# EAGLE schematic Inverter (EAGLE 9.6.2)
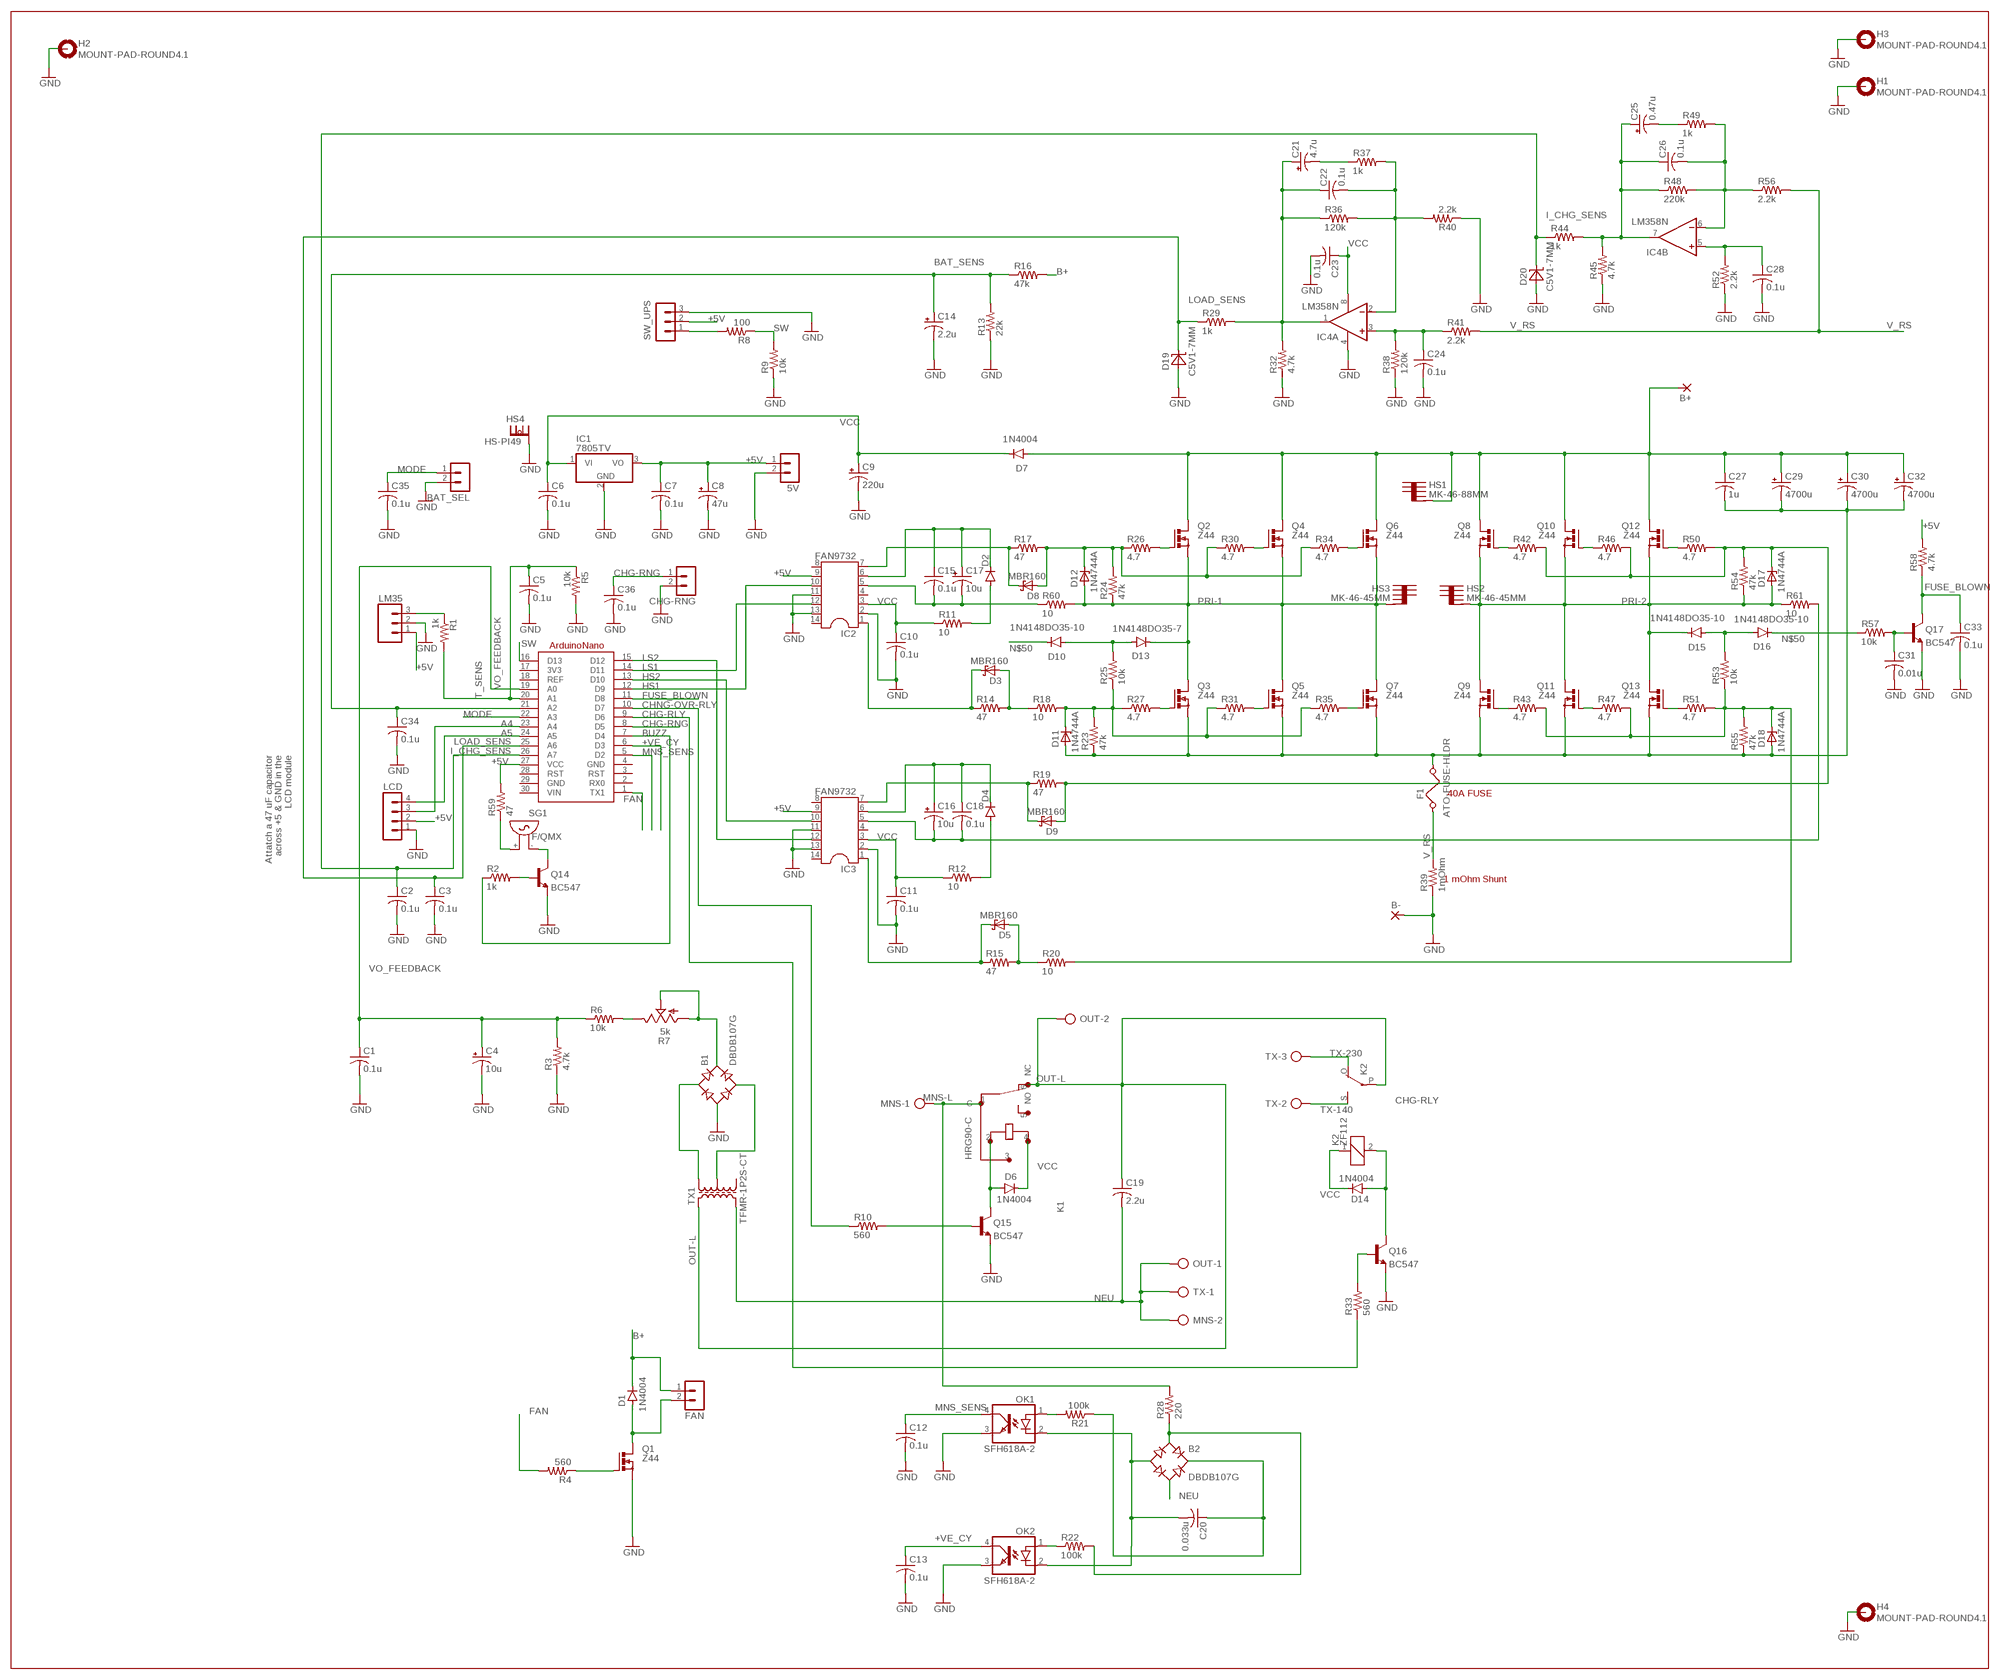
[diagram p0: schematic, sheet 1]

## Parts
5V  MA02-1  [MA02-1]
A1  ARDUINONANO-MIN-TXT  [ARDUINONANO-MINIMUM-TXT]
B1  DBDB107G  [DB]
B2  DBDB107G  [DB]
B+  3,17/1,1  [3,17/1,1]
B-  3,17/1,1  [3,17/1,1]
BAT_SEL  MA02-1  [MA02-1]
C1  0.1u  C-US025-025X050  [C025-025X050]
C2  0.1u  C-US025-025X050  [C025-025X050]
C3  0.1u  C-US025-025X050  [C025-025X050]
C4  10u  CPOL-USE2,5-6E  [E2,5-6E]
C5  0.1u  C-US025-025X050  [C025-025X050]
C6  0.1u  C-US025-025X050  [C025-025X050]
C7  0.1u  C-US025-025X050  [C025-025X050]
C8  47u  CPOL-USE2,5-6E  [E2,5-6E]
C9  220u  CPOL-USE2,5-6E  [E2,5-6E]
C10  0.1u  C-US025-025X050  [C025-025X050]
C11  0.1u  C-US025-025X050  [C025-025X050]
C12  0.1u  C-US025-025X050  [C025-025X050]
C13  0.1u  C-US025-025X050  [C025-025X050]
C14  2.2u  CPOL-USE2.5-6  [E2,5-6]
C15  0.1u  C-US025-025X050  [C025-025X050]
C16  10u  CPOL-USE2,5-6E  [E2,5-6E]
C17  10u  CPOL-USE2,5-6E  [E2,5-6E]
C18  0.1u  C-US025-025X050  [C025-025X050]
C19  2.2u  C230-POLY  [C230-85X245]
C20  0.033u  C-US050-025X075  [C050-025X075]
C21  4.7u  CPOL-USE2.5-6  [E2,5-6]
C22  0.1u  C-US025-025X050  [C025-025X050]
C23  0.1u  C-US025-025X050  [C025-025X050]
C24  0.1u  C-US025-025X050  [C025-025X050]
C25  0.47u  CPOL-USE2.5-6  [E2,5-6]
C26  0.1u  C-US025-025X050  [C025-025X050]
C27  1u  C-US225-113X268  [C225-113X268]
C28  0.1u  C-US025-025X050  [C025-025X050]
C29  4700u  CPOL-USE10-20  [EB20D]
C30  4700u  CPOL-USE10-20  [EB20D]
C31  0.01u  C-US025-025X050  [C025-025X050]
C32  4700u  CPOL-USE10-20  [EB20D]
C33  0.1u  C-US025-025X050  [C025-025X050]
C34  0.1u  C-US025-025X050  [C025-025X050]
C35  0.1u  C-US025-025X050  [C025-025X050]
C36  0.1u  C-US025-025X050  [C025-025X050]
CHG-RNG  MA02-1  [MA02-1]
D1  1N4004  [DO41-10]
D2  1N4148DO35-10  [DO35-10]
D3  MBR160  [DO41-10]
D4  1N4148DO35-10  [DO35-10]
D5  MBR160  [DO41-10]
D6  1N4004  [DO41-10]
D7  1N4004  [DO41-10]
D8  MBR160  [DO41-10]
D9  MBR160  [DO41-10]
D10  1N4148DO35-10  [DO35-10]
D11  1N4744A  [DO41Z10]
D12  1N4744A  [DO41Z10]
D13  1N4148DO35-7  [DO35-7]
D14  1N4004  [DO41-10]
D15  1N4148DO35-10  [DO35-10]
D16  1N4148DO35-10  [DO35-10]
D17  1N4744A  [DO41Z10]
D18  1N4744A  [DO41Z10]
D19  C5V1-7MM  [DO35-7]
D20  C5V1-7MM  [DO35-7]
F1  ATO-FUSE-HLDR  [ATO-FUSE-HOLDER]
FAN  MA02-1  [MA02-1]
H1  MOUNT-PAD-ROUND4.1  [4,1-PAD]
H2  MOUNT-PAD-ROUND4.1  [4,1-PAD]
H3  MOUNT-PAD-ROUND4.1  [4,1-PAD]
H4  MOUNT-PAD-ROUND4.1  [4,1-PAD]
HS1  MK-46-88MM  [MK-46-88MM]
HS2  MK-46-45MM  [MK-46-45MM]
HS3  MK-46-45MM  [MK-46-45MM]
HS4  HS-PI49  [PI49-20MM]
IC1  7805TV  [TO220V]
IC2  FAN9732  DIL14S  [SOCKET-14]
IC3  FAN9732  DIL14S  [SOCKET-14]
IC4  LM358N  [DIL08]
K1  HRG90-C  [T90-C]
K2  ZF112  [ZF112]
LCD  MA04-1  [MA04-1]
LM35  MA03  [03P]
MNS  AK300/2  [AK300/2]
OK1  SFH618A-2  [DIP4]
OK2  SFH618A-2  [DIP4]
OUT  AK300/2  [AK300/2]
Q1  Z44  PMOSFET_NTO220BV  [TO220BV]
Q2  Z44  PMOSFET_NTO220BV  [TO220BV]
Q3  Z44  PMOSFET_NTO220BV  [TO220BV]
Q4  Z44  PMOSFET_NTO220BV  [TO220BV]
Q5  Z44  PMOSFET_NTO220BV  [TO220BV]
Q6  Z44  PMOSFET_NTO220BV  [TO220BV]
Q7  Z44  PMOSFET_NTO220BV  [TO220BV]
Q8  Z44  PMOSFET_NTO220BV  [TO220BV]
Q9  Z44  PMOSFET_NTO220BV  [TO220BV]
Q10  Z44  PMOSFET_NTO220BV  [TO220BV]
Q11  Z44  PMOSFET_NTO220BV  [TO220BV]
Q12  Z44  PMOSFET_NTO220BV  [TO220BV]
Q13  Z44  PMOSFET_NTO220BV  [TO220BV]
Q14  BC547  [TO92_LIN]
Q15  BC547  [TO92_LIN]
Q16  BC547  [TO92_LIN]
Q17  BC547  [TO92_LIN]
R1  1k  R-US_0207/10  [0207/10]
R2  1k  R-US_0207/10  [0207/10]
R3  4.7k  R-US_0207/10  [0207/10]
R4  560  R-US_0207/10  [0207/10]
R5  10k  R-US_0207/10  [0207/10]
R6  10k  R-US_0207/10  [0207/10]
R7  5k  TRIM_US-CA6V  [CA6V]
R8  100  R-US_0207/10  [0207/10]
R9  10k  R-US_0207/10  [0207/10]
R10  560  R-US_0207/10  [0207/10]
R11  10  R-US_0207/10  [0207/10]
R12  10  R-US_0207/10  [0207/10]
R13  22k  R-US_0207/10  [0207/10]
R14  47  R-US_0207/10  [0207/10]
R15  47  R-US_0207/10  [0207/10]
R16  47k  R-US_0207/10  [0207/10]
R17  47  R-US_0207/10  [0207/10]
R18  10  R-US_0207/10  [0207/10]
R19  47  R-US_0207/10  [0207/10]
R20  10  R-US_0207/10  [0207/10]
R21  100k  R-US_0411/3V  [0411V]
R22  100k  R-US_0411/15  [0411/15]
R23  47k  R-US_0207/10  [0207/10]
R24  47k  R-US_0207/10  [0207/10]
R25  10k  R-US_0207/10  [0207/10]
R26  4.7  R-US_0207/10  [0207/10]
R27  4.7  R-US_0207/10  [0207/10]
R28  220  R-US_0207/10  [0207/10]
R29  1k  R-US_0207/10  [0207/10]
R30  4.7  R-US_0207/10  [0207/10]
R31  4.7  R-US_0207/10  [0207/10]
R32  4.7k  R-US_0207/10  [0207/10]
R33  560  R-US_0207/10  [0207/10]
R34  4.7  R-US_0207/10  [0207/10]
R35  4.7  R-US_0207/10  [0207/10]
R36  120k  R-US_0207/10  [0207/10]
R37  1k  R-US_0207/10  [0207/10]
R38  120k  R-US_0207/10  [0207/10]
R39  1mOhm  SHUNT-RESISTOR  [SHUNT-R]
R40  2.2k  R-US_0207/10  [0207/10]
R41  2.2k  R-US_0207/10  [0207/10]
R42  4.7  R-US_0207/10  [0207/10]
R43  4.7  R-US_0207/10  [0207/10]
R44  1k  R-US_0207/10  [0207/10]
R45  4.7k  R-US_0207/10  [0207/10]
R46  4.7  R-US_0207/10  [0207/10]
R47  4.7  R-US_0207/10  [0207/10]
R48  220k  R-US_0207/10  [0207/10]
R49  1k  R-US_0207/10  [0207/10]
R50  4.7  R-US_0207/10  [0207/10]
R51  4.7  R-US_0207/10  [0207/10]
R52  2.2k  R-US_0207/10  [0207/10]
R53  10k  R-US_0207/10  [0207/10]
R54  47k  R-US_0207/10  [0207/10]
R55  47k  R-US_0207/10  [0207/10]
R56  2.2k  R-US_0207/10  [0207/10]
R57  10k  R-US_0207/10  [0207/10]
R58  4.7k  R-US_0207/10  [0207/10]
R59  47  R-US_0207/10  [0207/10]
R60  10  R-US_0207/10  [0207/10]
R61  10  R-US_0207/10  [0207/10]
SG1  F/QMX  [F/QMX]
SW_UPS  MA03-1  [MA03-1]
TX  AK300/3  [AK300/3]
TX1  TRANSFORMER-1P2S-CT  [XFMR-1S2P-CT-41X34MM]

## Nets
+5V: 5V.1 A1.27(VCC) C7.1 C8.+ IC1.3(VO) IC2.9 IC3.9 LCD.2 LM35.1 R58.2 R59.2 SW_UPS.2
+VE_CY: A1.6(D3) C13.1 OK2.4(COL)
A4: A1.23(A4) LCD.3
A5: A1.24(A5) LCD.4
B+: B+.1(P) C27.1 C29.+ C30.+ C32.+ D1.C D7.A FAN.1 HS1.1(K) HS1.2(K) Q2.D Q4.D Q6.D Q8.D Q10.D Q12.D R16.2
BAT_SENS: A1.21(A2) C14.+ C34.1 R13.2 R16.1
BUZZ: A1.7(D4) R2.1
CHG-RLY: A1.9(D6) R33.1
CHG-RNG: A1.8(D5) C36.1 CHG-RNG.1
CHNG-OVR-RLY: A1.10(D7) R10.1
FAN: A1.1(TX1) R4.2
FUSE_BLOWN: A1.11(D8) C33.1 Q17.3(C) R58.1
GND: 5V.2 B1.- B-.1(P) BAT_SEL.2 C1.2 C2.2 C3.2 C4.- C5.2 C6.2 C7.2 C8.- C9.- C10.2 C11.2 C12.2 C13.2 C14.- C23.2 C24.2 C28.2 C31.2 C33.2 C34.2 C35.2 C36.2 CHG-RNG.2 D19.A D20.A H1.B4,1(MOUNT) H2.B4,1(MOUNT) H3.B4,1(MOUNT) H4.B4,1(MOUNT) HS4.1(K) HS4.2(K) IC1.2(GND) IC2.2 IC2.11 IC2.13 IC3.2 IC3.11 IC3.13 IC4.4(P:V-) LCD.1 LM35.2 OK1.3(EMIT) OK2.3(EMIT) Q1.S Q14.1(E) Q15.1(E) Q16.1(E) Q17.1(E) R3.1 R5.2 R9.1 R13.1 R32.1 R38.1 R39.P$1 R40.1 R45.1 R52.1 SW_UPS.3
HS1: A1.12(D9) IC2.10
HS2: A1.13(D10) IC3.10
I_CHG_SENS: A1.26(A7) C2.1 D20.C R44.1
LOAD_SENS: A1.25(A6) C3.1 D19.C R29.1
LS1: A1.14(D11) IC2.12
LS2: A1.15(D12) IC3.12
MNS-L: K1.1(C) MNS.1 R28.2
MNS_SENS: A1.5(D2) C12.1 OK1.4(COL)
MODE: A1.22(A3) BAT_SEL.1 C35.1
N$1: D4.A R12.2
N$2: Q15.2(B) R10.2
N$3: C15.1 C17.+ D2.C IC2.6
N$4: C16.+ C18.1 D4.C IC3.6
N$5: Q14.3(C) SG1.-
N$6: D8.A D12.C R17.2 R24.2 R26.1 R30.1 R34.1
N$7: D2.A R11.2
N$8: D8.C IC2.7 R17.1
N$9: D3.C IC2.1 R14.1
N$10: D9.C IC3.7 R19.1
N$11: D5.C IC3.1 R15.1
N$12: D11.C R18.2 R23.2 R25.1 R27.1 R31.1 R35.1
N$13: C27.2 C29.- C30.- C32.- D11.A D18.A F1.P$2 Q3.S Q5.S Q7.S Q9.S Q11.S Q13.S R23.1 R55.1
N$14: D9.A D17.C R19.2 R42.2 R46.2 R50.2 R54.2
N$15: D18.C R20.2 R43.2 R47.2 R51.2 R53.1 R55.2
N$16: Q2.G R26.2
N$17: C24.1 IC4.3(A:+IN) R38.2 R41.1
N$18: B1.AC1 TX1.10
N$19: C16.- C18.2 IC3.5 R61.2
N$20: LM35.3 R1.1
N$21: B1.AC2 TX1.8
N$22: C22.2 IC4.2(A:-IN) R36.2 R37.2 R40.2
N$23: B1.+ R7.A R7.S
N$24: Q14.2(B) R2.2
N$25: R6.2 R7.E
N$26: Q3.G R27.2
N$27: C15.2 C17.- IC2.5 R60.1
N$28: Q1.G R4.1
N$29: B2.AC1 R22.2 R28.1
N$30: D1.A FAN.2 Q1.D
N$31: D6.A K1.2(COIL2) Q15.3(C)
N$32: Q13.G R51.1
N$33: D14.A K2.2 Q16.3(C)
N$34: Q16.2(B) R33.2
N$35: Q12.G R50.1
N$36: OK1.1(A) R21.2
N$37: OK2.1(A) R22.1
N$38: B2.- C20.2 OK1.2(C) OK2.2(C)
N$39: B2.+ C20.1 R21.1
N$40: C21.+ C22.1 IC4.1(A:OUT) R29.2 R32.2 R36.1
N$41: C21.- R37.1
N$42: Q9.G R43.1
N$43: D10.A D13.A R25.2
N$44: Q4.G R30.2
N$45: Q6.G R34.2
N$46: Q8.G R42.1
N$47: Q10.G R46.1
N$48: Q11.G R47.1
N$49: Q5.G R31.2
N$50: D10.C D16.C R57.1
N$51: Q7.G R35.2
N$52: D15.A D16.A R53.2
N$53: D5.A R15.2 R20.1
N$54: D3.A R14.2 R18.1
N$55: C31.1 Q17.2(B) R57.2
N$56: R8.2 SW_UPS.1
N$57: C26.2 IC4.6(B:-IN) R48.2 R49.2 R56.1
N$58: C25.+ C26.1 IC4.7(B:OUT) R44.2 R45.2 R48.1
N$59: C28.1 IC4.5(B:+IN) R52.2
N$60: C25.- R49.1
N$61: R59.1 SG1.+
NEU: B2.AC2 C19.2 MNS.2 OUT.1 TX1.5 TX.1
OUT-L: C19.1 K1.6(NC) K2.P(2:P) OUT.2 TX1.1
PRI-1: D12.A D13.C HS3.1(K) HS3.2(K) Q2.S Q3.D Q4.S Q5.D Q6.S Q7.D R24.1 R60.2
PRI-2: D15.C D17.A HS2.1(K) HS2.2(K) Q8.S Q9.D Q10.S Q11.D Q12.S Q13.D R54.1 R61.1
SW: A1.16(D13) R8.1 R9.2
T_SENS: A1.20(A1) C5.1 R1.2 R5.1
TX-140: K2.S(2:S) TX.2
TX-230: K2.O(2:O) TX.3
V_RS: F1.P$1 R39.P$2 R41.2 R56.2
VCC: C6.1 C9.+ C10.1 C11.1 C23.1 D6.C D7.C D14.C IC1.1(VI) IC2.3 IC3.3 IC4.8(P:V+) K1.4(COIL1) K2.1 R11.1 R12.1
VO_FEEDBACK: A1.19(A0) C1.1 C4.+ R3.2 R6.1
Unconnected: A1.2(RX0) A1.3(RST) A1.28(RST) IC2.4 IC2.8 IC2.14 IC3.4 IC3.8 IC3.14 K1.3(C) K1.5(NO) TX1.6

## Notes on the sheet
- Attatch a 47 uF capacitor
  across +5 & GND in the
  LCD module
- 40A FUSE
- 1 mOhm Shunt

## Power pins joined to a net without a drawn wire
3V3: A1.17(3V3)
GND: A1.4(GND) A1.29(GND)
REF: A1.18(REF)
VIN: A1.30(VIN)

## Library data of the parts
5V BAT_SEL CHG-RNG FAN = con-lstb:MA02-1: PIN HEADER
A1 = ArduinoNano:ARDUINONANO
B1 B2 = rectifier:DB?*G: Single Phase 1.0 AMP Glass Passivated Bridge Rectifier Taiwan Semiconductor Co.,Ltd. - TSC Source: http://www.taiwansemi.com/TSCbig5/ezcatfiles/cust/img/img/db101g.pdf http://www.ts.com.tw/db/pictures/modules/PDT/PDT060207001/DBLS201G.pdf
B+ B- = wirepad:3,17/1,1: THROUGH-HOLE PAD
C1-C3 C5-C7 C10-C13 C15 C18 C20 C22-C24 C26-C28 C31 C33-C36 = rcl:C-US: CAPACITOR, American symbol; SPICEPREFIX: C
C4 C8 C9 C14 C16 C17 C21 C25 C29 C30 C32 = rcl:CPOL-US: POLARIZED CAPACITOR, American symbol; SPICEPREFIX: C
C19 = SayantansOwn:C230-POLY: CAPACITOR, POLYESTER FILM Grid = 23 mm, Outline = 8.5 x 24.5 mm e.x. 0.2 uF, 400 V capacitor
D1 D6 D7 D14 = diode:1N4004: DIODE general purpose rectifier, 1 A
D2 D4 D10 D13 D15 D16 = diode:1N4148: DIODE high speed (Philips)
D3 D5 D8 D9 = diode:MBR160: DIODE SCHOTTKY BARRIER RECTIFIERS, 1A, 60V https://www.onsemi.com/pdf/datasheet/mbr150-d.pdf
D11 D12 D17 D18 = diode:1N4744A: Z DIODE 15 V, 1W, 5 percent
D19 D20 = diode:C5V1: ZENER DIODE 5.1 V, 500 mW
F1 = SayantansOwn:ATO-FUSE: BLADE FUSE REGULAR (ATO) 19.1 × 5.1 × 18.5 mm, 32 V
H1-H4 = holes:MOUNT-PAD-ROUND: MOUNTING PAD, round
HS1 = SayantansOwn:MK-46-88MM: HEATSINK MK-46 or SK 32 Top = 88 x 31 mm, Bottom = 88 x 17 mm, Height = 58 mm (Fins at single side 30 mm)
HS2 HS3 = SayantansOwn:MK-46-45MM: HEATSINK MK-46 or SK 32 Top = 88 x 31 mm, Bottom = 88 x 17 mm, Height = 58 mm (Fins at single side 30 mm)
HS4 = SayantansOwn:HS-PI49: HEATSINK PI49 TO220, 16 x 12.5 mm, Height = 20 mm
IC1 = linear:78*: Positive VOLTAGE REGULATOR Source: http://cache.national.com/ds/LM/LM78L05.pdf http://www.fairchildsemi.com/ds/LM/LM7805.pdf
IC2 IC3 = ic-package:DIL14: Dual In Line / Socket
IC4 = linear:LM358: OP AMP also LM158; LM258; LM2904 Source: http://cache.national.com/ds/LM/LM158.pdf
K1 = SayantansOwn:HRG90-: General purpose relay. [NO: 30 A 250 VAC/30 VDC], [NC: 20 A 250 VAC/30 VDC] Coil voltage rating: 12 VDC, Operate Voltage: 9 VDC, Release Voltage: 1.2 VDC, Max. voltage: 15.6 VDC, Coil resistance: 155×（ 1±10%） Ω Contact Resistance: 50mΩ (1A 6VDC) PCB coil terminal, ideal for heavy duty load 2.5KV dielectric stength (between coil and contacts) Datasheet source: https://www.hirelay.com/HRG90-p.html
K2 = relay:ZF112: RELAY 1 x switch; OC_FARNELL: unknown; OC_NEWARK: unknown
LCD = con-lstb:MA04-1: PIN HEADER; OC_FARNELL: unknown; OC_NEWARK: unknown
LM35 = con-amp-quick:MA03: AMP QUICK CONNECTOR; OC_FARNELL: unknown; OC_NEWARK: unknown
MNS OUT = con-ptr500:AK300/2: CONNECTOR; OC_FARNELL: unknown; OC_NEWARK: unknown
OK1 OK2 = optocoupler:SFH618?*: Optocoupler, Phototransistor Output, Low Input Current Source: Data sheet <http://www.vishay.com/docs/83673/sfh618.pdf>; MF: VISHAY/TELEFUNKEN; MPN: SFH618A-2; OC_FARNELL: 6424855; OC_NEWARK: 21H7744
Q1-Q13 = transistor-power:PMOSFET_N: Power MOSFET N-Channel
Q14-Q17 = SayantansOwn:BC547: NPN TRANSISTOR
R1-R6 R8-R38 R40-R61 = rcl:R-US_: RESISTOR, American symbol; SPICEPREFIX: R
R7 = pot:TRIM_US-: POTENTIOMETER
R39 = SayantansOwn:SHUNT-RESISTOR
SG1 = buzzer:F/QMX: BUZZER Source: Buerklin; OC_FARNELL: unknown; OC_NEWARK: unknown
SW_UPS = con-lstb:MA03-1: PIN HEADER; OC_FARNELL: unknown; OC_NEWARK: unknown
TX = con-ptr500:AK300/3: CONNECTOR; OC_FARNELL: unknown; OC_NEWARK: unknown
TX1 = SayantansOwn:TRANSFORMER-1P2S-CT: Transformer with 1 primary and 1 secondery coil with center-tapping.